# EAGLE design untitled (EAGLE 5.12)
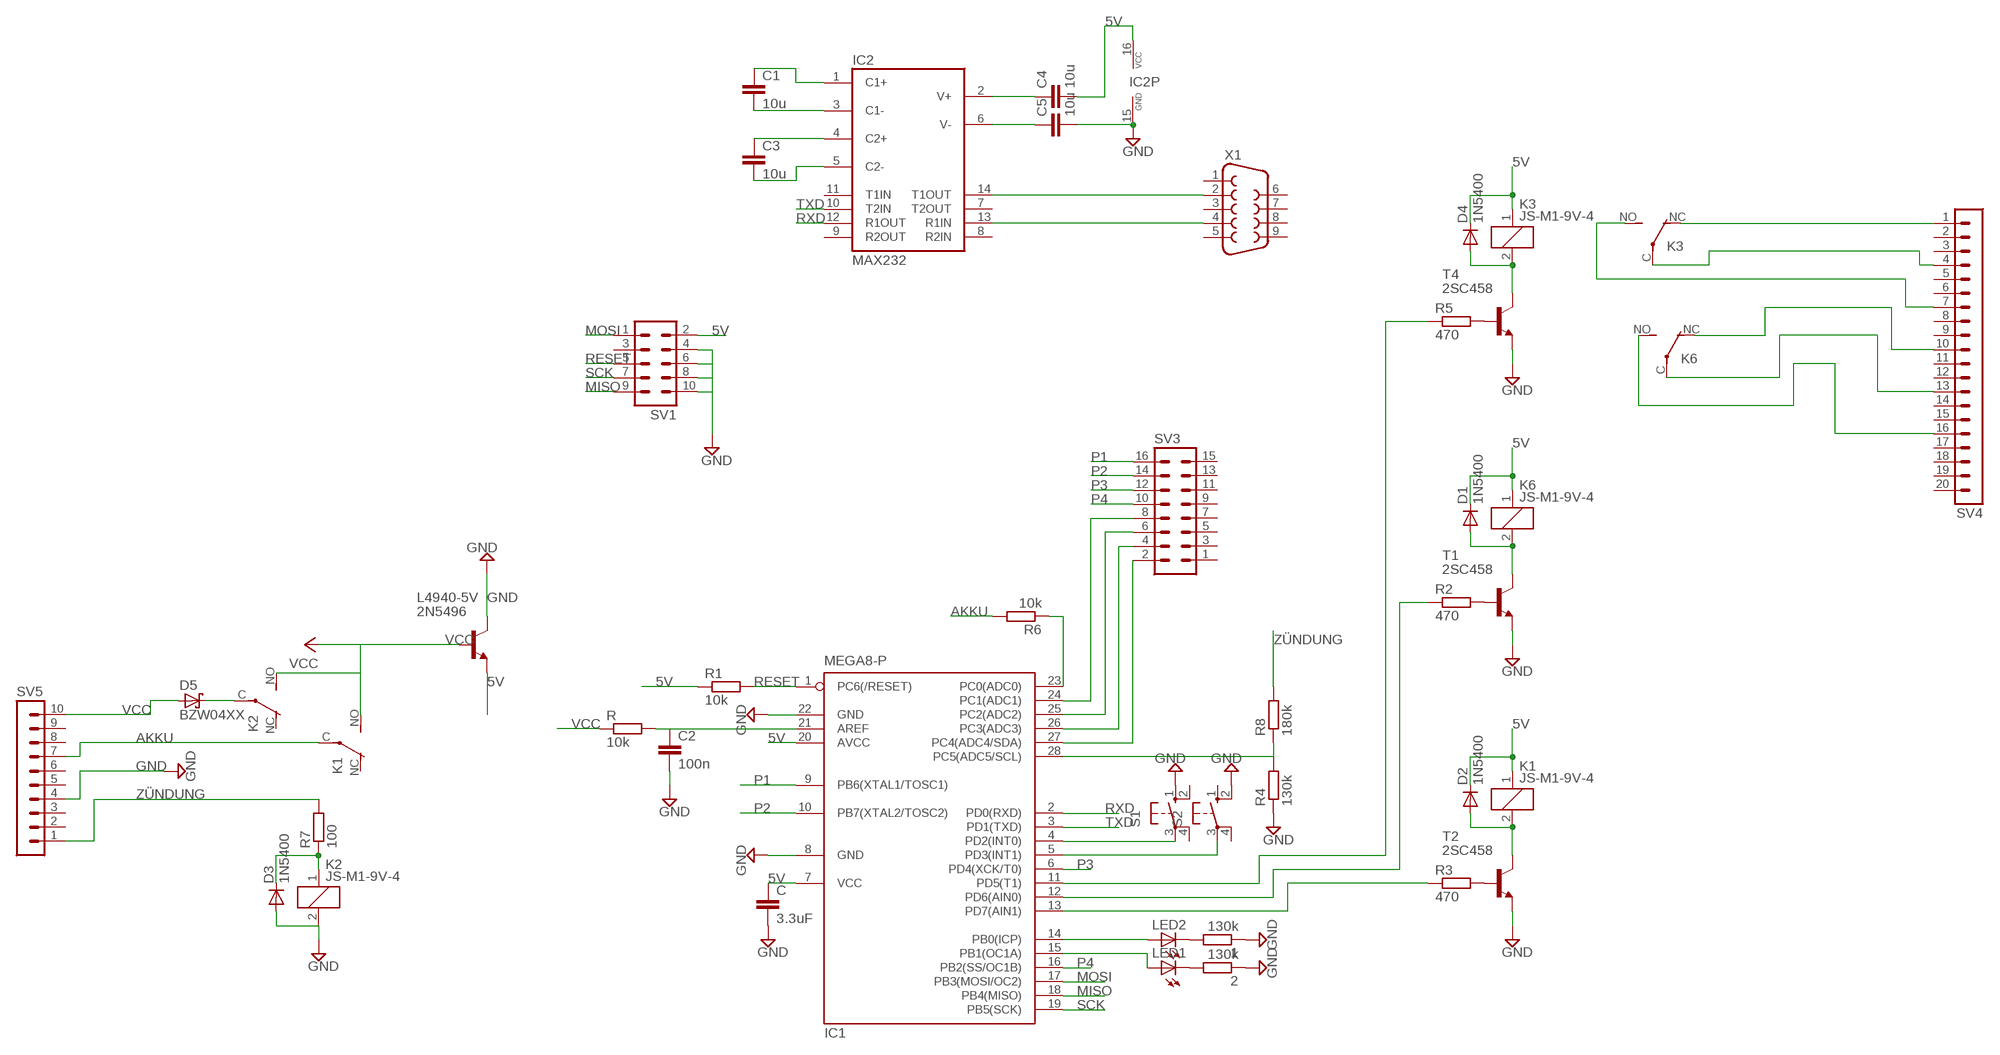
[diagram p0: schematic, sheet 1]

## Parts
1  130k  R-EU_0411/15  [0411/15]
2  130k  R-EU_0411/15  [0411/15]
C  3.3uF  C10/6  [C10B6]
C1  10u  C10/6  [C10B6]
C2  100n  C10/6  [C10B6]
C3  10u  C10/6  [C10B6]
C4  10u  C10/6  [C10B6]
C5  10u  C10/6  [C10B6]
D1  1N5400  [DO201-15]
D2  1N5400  [DO201-15]
D3  1N5400  [DO201-15]
D4  1N5400  [DO201-15]
D5  BZW04XX  [F126Z12]
IC1  MEGA8-P  [DIL28-3]
IC2  MAX232  [DIL16]
K1  JS-M1-9V-4  [JS-M]
K2  JS-M1-9V-4  [JS-M]
K3  JS-M1-9V-4  [JS-M]
K6  JS-M1-9V-4  [JS-M]
L4940-5V  2N5496  [TO220]
LED1  LED5MM  [LED5MM]
LED2  LED5MM  [LED5MM]
R  10k  R-EU_0411/15  [0411/15]
R1  10k  R-EU_0411/15  [0411/15]
R2  470  R-EU_0411/15  [0411/15]
R3  470  R-EU_0411/15  [0411/15]
R4  130k  R-EU_0411/15  [0411/15]
R5  470  R-EU_0411/15  [0411/15]
R6  10k  R-EU_0411/15  [0411/15]
R7  100  R-EU_0411/15  [0411/15]
R8  180k  R-EU_0411/15  [0411/15]
S1  10-XX  [B3F-10XX]
S2  10-XX  [B3F-10XX]
SV1  MA05-2  [MA05-2]
SV3  MA08-2  [MA08-2]
SV4  MA20-1  [MA20-1]
SV5  MA10-1  [MA10-1]
T1  2SC458  [TO92-ECB]
T2  2SC458  [TO92-ECB]
T4  2SC458  [TO92-ECB]
X1  F09HP  [F09HP]

## Nets
5V: C4.2 C.1 D1.C D2.C D4.C IC1.7(VCC) IC1.20(AVCC) IC2.16(VCC) K1.1 K3.1 K6.1 L4940-5V.3(E) R1.1 SV1.2
AKKU: K1.C(2:P) R6.2 SV5.7
GND: 1.1 2.1 C2.2 C5.2 C.2 D3.A IC1.8(GND) IC1.22(GND) IC2.15(GND) K2.2 L4940-5V.2(C) R4.1 S1.1(S) S2.2(S1) SV1.4 SV1.6 SV1.8 SV1.10 SV5.4 T1.E T2.E T4.E
MISO: IC1.18(PB4(MISO)) SV1.9
MOSI: IC1.17(PB3(MOSI/OC2)) SV1.1
N$1: D5.C K2.C(2:P)
N$2: R2.2 T1.B
N$3: K6.NC(2:O) SV4.10
N$4: K6.C(2:P) SV4.13
N$5: K6.NO(2:S) SV4.16
N$6: C2.1 IC1.21(AREF) R.2
N$7: D5.A SV5.10
N$8: D1.A K6.2 T1.C
N$9: IC1.28(PC5(ADC5/SCL)) R4.2 R8.1
N$10: D2.A K1.2 T2.C
N$11: R3.2 T2.B
N$12: C1.2 IC2.3(C1-)
N$13: C1.1 IC2.1(C1+)
N$14: C3.1 IC2.4(C2+)
N$15: C3.2 IC2.5(C2-)
N$16: C4.1 IC2.2(V+)
N$17: K3.C(2:P) SV4.4
N$18: K3.NO(2:S) SV4.7
N$19: K3.NC(2:O) SV4.1
N$20: D4.A K3.2 T4.C
N$21: R5.2 T4.B
N$22: IC1.13(PD7(AIN1)) R3.1
N$23: IC1.12(PD6(AIN0)) R2.1
N$24: IC1.23(PC0(ADC0)) R6.1
N$25: IC1.11(PD5(T1)) R5.1
N$26: C5.1 IC2.6(V-)
N$27: IC2.14(T1OUT) X1.2
N$28: IC2.13(R1IN) X1.4
N$29: IC1.27(PC4(ADC4/SDA)) SV3.2
N$30: IC1.26(PC3(ADC3)) SV3.4
N$31: IC1.25(PC2(ADC2)) SV3.6
N$32: IC1.24(PC1(ADC1)) SV3.8
N$33: IC1.4(PD2(INT0)) S1.3(P)
N$34: IC1.5(PD3(INT1)) S2.3(P)
N$35: 2.2 LED1.K(C)
N$36: IC1.15(PB1(OC1A)) LED1.A
N$37: 1.2 LED2.K(C)
N$38: IC1.14(PB0(ICP)) LED2.A
N$39: D3.C K2.1 R7.1
P1: IC1.9(PB6(XTAL1/TOSC1)) SV3.16
P2: IC1.10(PB7(XTAL2/TOSC2)) SV3.14
P3: IC1.6(PD4(XCK/T0)) SV3.12
P4: IC1.16(PB2(SS/OC1B)) SV3.10
RESET: IC1.1(PC6(/RESET)) R1.2 SV1.5
RXD: IC1.2(PD0(RXD)) IC2.12(R1OUT)
SCK: IC1.19(PB5(SCK)) SV1.7
TXD: IC1.3(PD1(TXD)) IC2.10(T2IN)
VCC: K1.NO(2:S) K2.NO(2:S) L4940-5V.1(B) R.1
ZÜNDUNG: R7.2 R8.2 SV5.1
Unconnected: IC2.7(T2OUT) IC2.8(R2IN) IC2.9(R2OUT) IC2.11(T1IN) K1.NC(2:O) K2.NC(2:O) S1.2(S1) S1.4(P1) S2.1(S) S2.4(P1) SV1.3 SV3.1 SV3.3 SV3.5 SV3.7 SV3.9 SV3.11 SV3.13 SV3.15 SV4.2 SV4.3 SV4.5 SV4.6 SV4.8 SV4.9 SV4.11 SV4.12 SV4.14 SV4.15 SV4.17 SV4.18 SV4.19 SV4.20 SV5.2 SV5.3 SV5.5 SV5.6 SV5.8 SV5.9 X1.1 X1.3 X1.5 X1.6 X1.7 X1.8 X1.9

## Library data of the parts
1 2 R R1-R8 = rcl:R-EU_: RESISTOR, European symbol
C C1-C5 = capacitor-wima:C: CAPACITOR naming: grid - package width
D1-D4 = diode:1N5400: DIODE standard rectifier, 3 A, 50 V (Motorola)
D5 = diode:BZW04XX: DIODE
IC1 = atmel:MEGA8-P: MICROCONTROLLER 8 Kbytes FLASH, 1 kbytes SRAM, 512 bytes EEPROM, USART, 4-channel 10 bit ADC, 2-channel 8 bit ADC Pin compatible with Atmega48, ATMega88, ATMega168 Source: avr.lbr; OC_FARNELL: unknown; OC_NEWARK: unknown
IC2 = maxim:MAX232: RS232 TRANSEIVER; MF: MAXIM; MPN: MAX232ACPE+; OC_FARNELL: 9723773; OC_NEWARK: 68K4544
K1-K3 K6 = relay:JS-M1*: Automotive Ultra-Miniature Power Relay NAiS Source: http://www.mew-europe.com/.. en_ds_61211_0000.pdf; OC_FARNELL: unknown; OC_NEWARK: unknown
L4940-5V = transistor:2N5496: NPN TRANSISTOR
LED1 LED2 = led:LED: LED OSRAM: - CHIPLED LG R971, LG N971, LY N971, LG Q971, LY Q971, LO R971, LY R971 LH N974, LH R974 LS Q976, LO Q976, LY Q976 LO Q996 - Hyper CHIPLED LW Q18S LB Q993, LB Q99A, LB R99A - SideLED LS A670, LO A670, LY A670, LG A670, LP A670 LB A673, LV A673, LT A673, LW A673 LH A674 LY A675 LS A676, LA A676, LO A676, LY A676, LW A676 LS A679, LY A679, LG A679 - Hyper Micro SIDELED® LS Y876, LA Y876, LO Y876, LY Y876 LT Y87S - SmartLED LW L88C, LW L88S LB L89C, LB L89S, LG L890 LS L89K, LO L89K, LY L89K LS L896, LA L896, LO L896, LY L896 - TOPLED LS T670, LO T670, LY T670, LG T670, LP T670 LSG T670, LSP T670, LSY T670, LOP T670, LYG T670 LG T671, LOG T671, LSG T671 LB T673, LV T673, LT T673, LW T673 LH T674 LS T676, LA T676, LO T676, LY T676, LB T676, LH T676, LSB T676, LW T676 LB T67C, LV T67C, LT T67C, LS T67K, LO T67K, LY T67K, LW E67C LS E67B, LA E67B, LO E67B, LY E67B, LB E67C, LV E67C, LT E67C LW T67C LS T679, LY T679, LG T679 LS T770, LO T770, LY T770, LG T770, LP T770 LB T773, LV T773, LT T773, LW T773 LH T774 LS E675, LA E675, LY E675, LS T675 LS T776, LA T776, LO T776, LY T776, LB T776 LHGB T686 LT T68C, LB T68C - Hyper Mini TOPLED® LB M676 - Mini TOPLED Santana® LG M470 LS M47K, LO M47K, LY M47K Source: http://www.osram.convergy.de LUXEON: - LUMILED® LXK2-PW12-R00, LXK2-PW12-S00, LXK2-PW14-U00, LXK2-PW14-V00 LXK2-PM12-R00, LXK2-PM12-S00, LXK2-PM14-U00 LXK2-PE12-Q00, LXK2-PE12-R00, LXK2-PE12-S00, LXK2-PE14-T00, LXK2-PE14-U00 LXK2-PB12-K00, LXK2-PB12-L00, LXK2-PB12-M00, LXK2-PB14-N00, LXK2-PB14-P00, LXK2-PB14-Q00 LXK2-PR12-L00, LXK2-PR12-M00, LXK2-PR14-Q00, LXK2-PR14-R00 LXK2-PD12-Q00, LXK2-PD12-R00, LXK2-PD12-S00 LXK2-PH12-R00, LXK2-PH12-S00 LXK2-PL12-P00, LXK2-PL12-Q00, LXK2-PL12-R00 Source: www.luxeon.com KINGBRIGHT: KA-3528ASYC Source: www.kingbright.com
S1 S2 = switch-omron:10-XX: OMRON SWITCH; MPN: B3F-1000; OC_FARNELL: 176432; OC_NEWARK: 36M3542
SV1 = con-lstb:MA05-2: PIN HEADER; OC_FARNELL: unknown; OC_NEWARK: unknown
SV3 = con-lstb:MA08-2: PIN HEADER; OC_FARNELL: unknown; OC_NEWARK: unknown
SV4 = con-lstb:MA20-1: PIN HEADER; OC_FARNELL: unknown; OC_NEWARK: unknown
SV5 = con-lstb:MA10-1: PIN HEADER; OC_FARNELL: unknown; OC_NEWARK: unknown
T1 T2 T4 = transistor:2SC458: NPN Silicon Epitaxial Planar Transistor Source: SEMTECH ELECTRONICS LTD. ... 2SC458 1.pdf
X1 = con-subd:F09: SUB-D; OC_FARNELL: unknown; OC_NEWARK: unknown

## Board
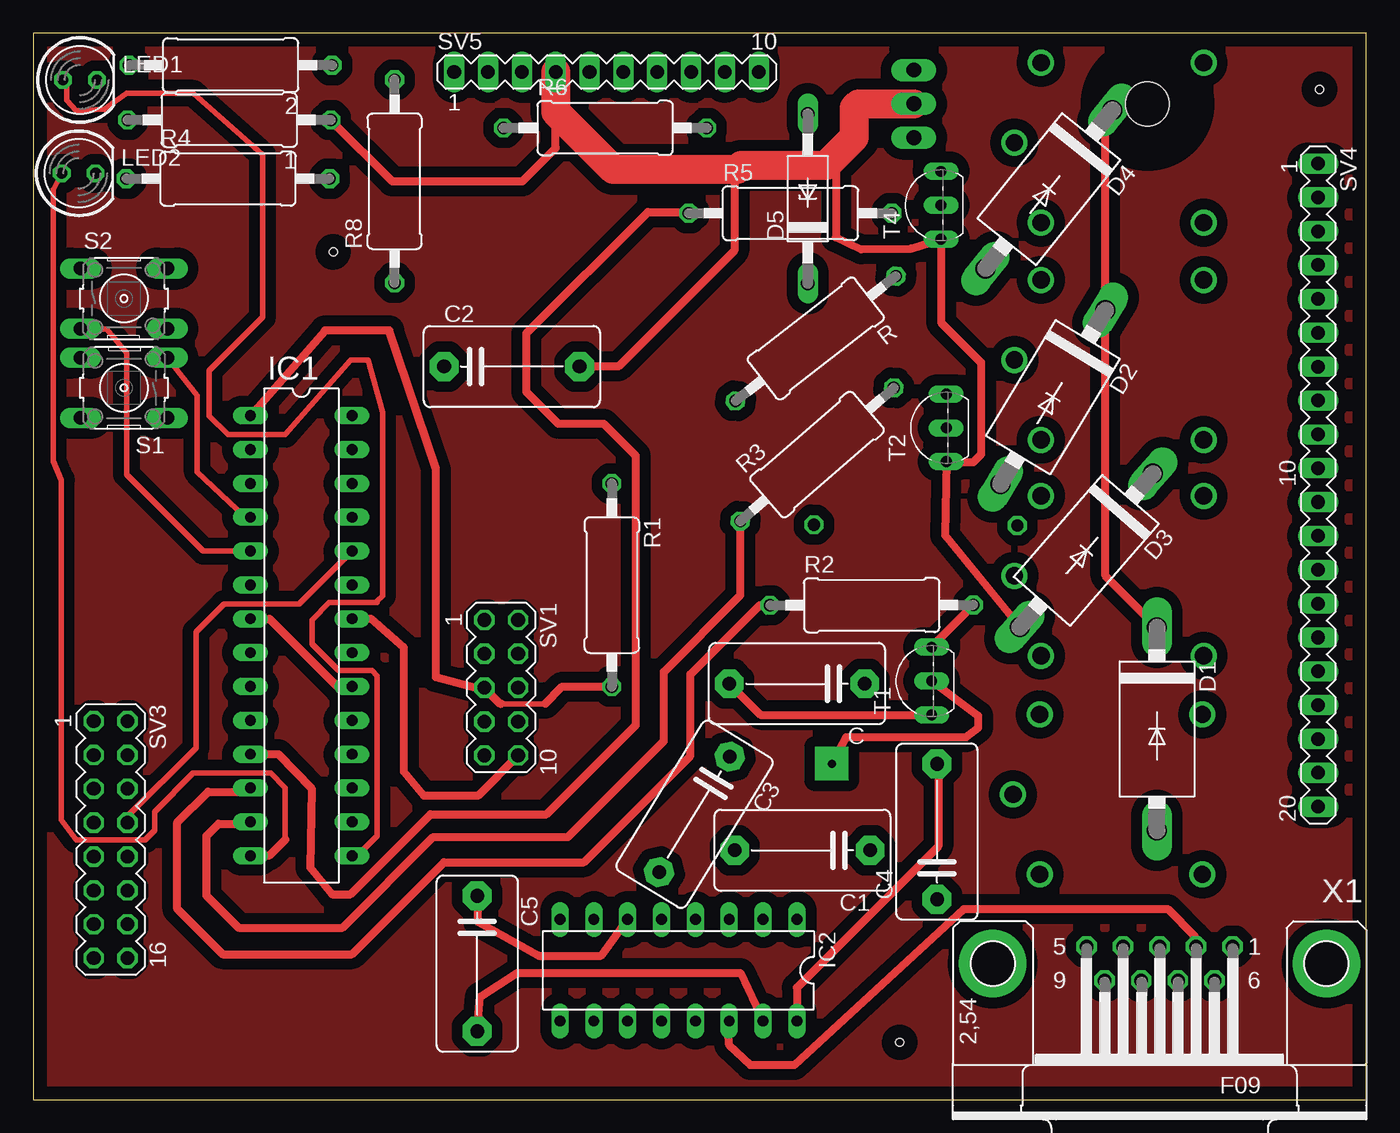
[diagram p1: board, top side]
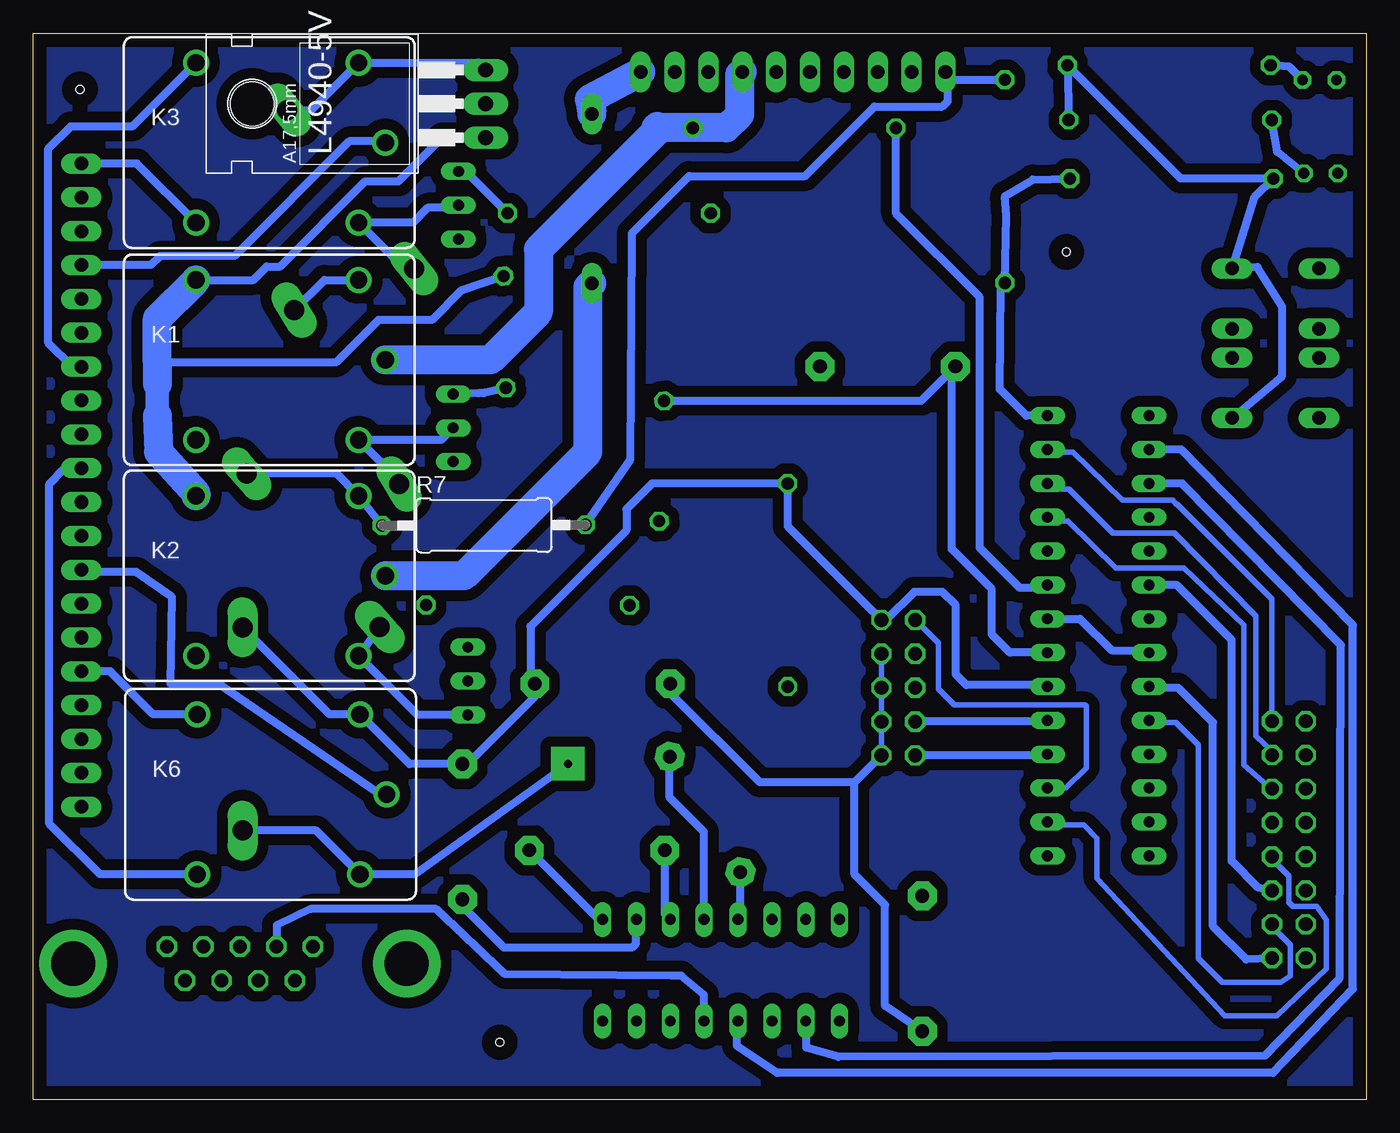
[diagram p2: board, bottom side, seen from below]

Size 100 x 80 mm. Coordinates in mm from the lower left corner, seen from the top.
Outline: 0,0 100,0 100,80 0,80 0,0
Copper layers (1*16): Top 0.035mm / dielectric 1.5mm / Bottom 0.035mm
Design rules "default": minimum track width 10mil, minimum drill 24mil, track to track 8mil, track to pad 8mil, pad to pad 8mil, via to via 8mil, smd to smd 8mil, copper to edge 40mil, drill to drill 8mil, minimum pad ring 10mil, minimum via ring 8mil, stop-mask expansion 4mil, vias tented up to drill 0mil, thermal gap 10mil
Holes 0.6 mm at 65,4.3 22.5,63.6 96.5,75.8

### Footprints (pad centres in the part's own frame; a part is rotated, then mirrored left to right if it is on the bottom)
0411/15 = drill 0.914 octagon: 1 -7.62,0; 2 7.62,0
C10B6 = drill 1.016 pad 2.159 octagon: 1 -5.08,0; 2 5.08,0
DO201-15 = drill 1.499 long: A 7.62,0; C -7.62,0
F126Z12 = drill 1.016 long: A 6.35,0; C -6.35,0
DIL28-3 = drill 0.813 long: 1 -16.51,-3.81; 2 -13.97,-3.81; 3 -11.43,-3.81; 4 -8.89,-3.81; 5 -6.35,-3.81; 6 -3.81,-3.81; 7 -1.27,-3.81; 8 1.27,-3.81; 9 3.81,-3.81; 10 6.35,-3.81; 11 8.89,-3.81; 12 11.43,-3.81; 13 13.97,-3.81; 14 16.51,-3.81; 15 16.51,3.81; 16 13.97,3.81; 17 11.43,3.81; 18 8.89,3.81; 19 6.35,3.81; 20 3.81,3.81; 21 1.27,3.81; 22 -1.27,3.81; 23 -3.81,3.81; 24 -6.35,3.81; 25 -8.89,3.81; 26 -11.43,3.81; 27 -13.97,3.81; 28 -16.51,3.81
DIL16 = drill 0.813 long: 1 -8.89,-3.81; 2 -6.35,-3.81; 3 -3.81,-3.81; 4 -1.27,-3.81; 5 1.27,-3.81; 6 3.81,-3.81; 7 6.35,-3.81; 8 8.89,-3.81; 9 8.89,3.81; 10 6.35,3.81; 11 3.81,3.81; 12 1.27,3.81; 13 -1.27,3.81; 14 -3.81,3.81; 15 -6.35,3.81; 16 -8.89,3.81
JS-M = drill 1.3 round: 1 6.7,6; 2 6.7,-6; C 8.7,0; NC -5.5,-6; NO -5.5,6
TO220 = drill 1.118 long: 1 -2.54,-6.35; 2 0,-6.35; 3 2.54,-6.35 | hole 3.302: 0,11.176
LED5MM = drill 0.813 octagon: A -1.27,0; K 1.27,0
B3F-10XX = drill 1.016 long: 1 -3.251,2.261; 2 3.251,2.261; 3 -3.251,-2.261; 4 3.251,-2.261
MA05-2 = drill 1.016 octagon: 1 -5.08,-1.27; 2 -5.08,1.27; 3 -2.54,-1.27; 4 -2.54,1.27; 5 0,-1.27; 6 0,1.27; 7 2.54,-1.27; 8 2.54,1.27; 9 5.08,-1.27; 10 5.08,1.27
MA08-2 = drill 1.016 octagon: 1 -8.89,-1.27; 2 -8.89,1.27; 3 -6.35,-1.27; 4 -6.35,1.27; 5 -3.81,-1.27; 6 -3.81,1.27; 7 -1.27,-1.27; 8 -1.27,1.27; 9 1.27,-1.27; 10 1.27,1.27; 11 3.81,-1.27; 12 3.81,1.27; 13 6.35,-1.27; 14 6.35,1.27; 15 8.89,-1.27; 16 8.89,1.27
MA20-1 = drill 1.016 long: 1 -24.13,0; 2 -21.59,0; 3 -19.05,0; 4 -16.51,0; 5 -13.97,0; 6 -11.43,0; 7 -8.89,0; 8 -6.35,0; 9 -3.81,0; 10 -1.27,0; 11 1.27,0; 12 3.81,0; 13 6.35,0; 14 8.89,0; 15 11.43,0; 16 13.97,0; 17 16.51,0; 18 19.05,0; 19 21.59,0; 20 24.13,0
MA10-1 = drill 1.016 long: 1 -11.43,0; 2 -8.89,0; 3 -6.35,0; 4 -3.81,0; 5 -1.27,0; 6 1.27,0; 7 3.81,0; 8 6.35,0; 9 8.89,0; 10 11.43,0
TO92-ECB = drill 0.813 long: B 2.54,0; C 0,0; E -2.54,0
F09HP = drill 1.016 octagon: 1 -5.486,-1.27; 2 -2.743,-1.27; 3 0,-1.27; 4 2.743,-1.27; 5 5.486,-1.27; 6 -4.115,1.27; 7 -1.372,1.27; 8 1.372,1.27; 9 4.115,1.27 | drill 3.302 pad 5.08 round: G1 -12.522,0; G2 12.522,0

### Placement (x,y rotation side)
1  14.7,73.5 180 top
2  14.8,77.6 180 top
C  57.3,31.2 180 top
C1  57.7,18.7 180 top
C2  35.9,55 0 top
C3  49.6,21.4 238.5 top
C4  67.8,20.1 90 top
C5  33.3,10.2 270 top
D1  84.3,27.8 270 top
D2  76.5,52.7 238.9 top
D3  79,41.2 229 top
D4  76.2,68.3 231.3 top
D5  58.1,67.6 90 top
IC1  20.1,34.8 270 top
IC2  48.4,9.7 180 top
K1  82.3,55.5 0 bottom
K2  82.3,39.3 0 bottom
K3  82.3,71.8 0 bottom
K6  82.2,22.9 0 bottom
L4940-5V  72.41,74.71 90 bottom
LED1  3.5,76.5 0 top
LED2  3.4,69.5 0 top
R  58.7,57.1 217.9 top
R1  43.4,38.6 270 top
R2  62.9,37.1 0.1 top
R3  58.8,48.4 41 top
R4  14.6,69.1 0 top
R5  56.8,66.5 0 top
R6  42.9,72.9 0 top
R7  66.2,43.1 0.2 bottom
R8  27.1,68.9 90 top
S1  6.8,53.4 180 top
S2  6.8,60.1 0 top
SV1  35.1,30.9 270 top
SV3  5.8,19.5 270 top
SV4  96.4,46.1 270 top
SV5  43,77.1 0 top
T1  67.4,31.4 90 top
T2  68.5,50.4 90 top
T4  68.1,67.1 90 top
X1  84.5,10.2 180 top

### Tracks (layer width: path | path; a pad name or v marks a point on that pad's centre or on a via)
5V
  Top 0.61: IC2.16 57.29,8.39 67.9,19 67.9,25.08 C4.2 | IC1.7 17.73,36.07 22.8,31 IC1.20 | D1.C 80.44,39.28 D2.C 80.44,73.72 D4.C
  Bottom 0.61: IC1.20 24.02,31.1 30,31.1 30.8,31.9 30.8,37.1 31.8,38.1 33.9,38.1 36.02,35.98 SV1.2 43.4,43.01 R1.1 53.58,46.22 55.5,44.3 55.5,42.7 62.7,35.5 62.7,31.52 C.1 62.38,30.22 67.9,24.7 67.9,25.08 C4.2 71.78,25.18 K6.1 77.78,28.9 D1.C | D2.C 78.16,61.5 K1.1 | L4940-5V.3 66.61,77.8 K3.1 79.15,74.25 D4.C
AKKU
  Bottom 0.61: R6.2 53.1,72.9 53.2,73
  Bottom 2.184: K1.C 65.7,55.5 62.1,59.1 62.1,63.8 53.2,72.7 53.2,73 53.3,72.9 48,72.9 47,73.9 47,76.91 SV5.7
GND
  Top 0.61: 62.1,74.2 61.01,71.61 60.2,69.7 60.2,64.7 62.1,63.8 65.86,63.86 T4.E 68.1,58.3 71.1,55.3 71.1,48.4 70.5,47.8 68.56,47.8 T2.E 68.4,42.35 D3.A | L4940-5V.2 | C5.2 33.5,7.7 36.3,9.5 53.04,9.5 IC2.15 54.75,5.85 54.7,5.8 | C2.2 43.9,55 52.6,63.7 52.6,69.6 53.1,70.1 | T1.E 54.56,28.86 C.2 | IC1.22 25.33,36.07 27.8,33.9 27.8,24.6 29.3,22.8 33.35,22.8 SV1.10 | SV5.4 39.19,71.39 36.7,68.9 26.92,68.9 1.1
  Top 2.184: SV5.4 39.19,74.11 43.5,69.8 52.8,69.8 53.1,70.1 59.5,70.1 61.01,71.61 61.6,72.2 61.6,74.4 61.91,74.71 L4940-5V.2
  Bottom 0.406: SV1.10 SV1.8 SV1.6 SV1.4
  Bottom 0.61: T1.E 71.16,28.86 K2.2 D3.A | 1.1 2.1 13.92,69.1 R4.1 8.35,67.73 S2.2 8.16,62.46 6.3,59.5 6.3,54.29 S1.1 | IC1.22 21.47,36.07 19.1,33.7 16.46,33.7 IC1.8 | C.2 52.22,30.52 45.5,23.8 38.39,23.8 | 38.39,23.8 SV1.10 | 38.39,23.8 38.39,16.89 36.1,14.6 36.1,7.02 C5.2
MISO
  Bottom 0.61: SV1.9 24,25.82 IC1.18
MOSI
  Bottom 0.406: IC1.17 22.53,23.37 21,24.9 21,29.5 21.1,29.6 30.9,29.6 32.1,30.8 32.1,34.25 SV1.1
N$1
  Bottom 2.184: K2.C 67.7,39.3 58.4,48.6 58.4,60.95 D5.C
N$2
  Top 0.61: T1.B 67.4,33.99 R2.2
N$3
  Bottom 0.61: K6.NC 95,16.9 98.8,20.7 98.8,46.2 97.7,47.3 96.47,47.3 SV4.10
N$4
  Bottom 0.61: K6.C 74,22.9 86.1,31.2 89.7,31.2 89.6,37.7 92.3,39.6 96.25,39.6 SV4.13
N$5
  Bottom 0.61: SV4.16 94.23,32.13 91,28.9 K6.NO
N$6
  Bottom 0.61: IC1.21 26.73,33.53 28.1,34.9 28.1,38.3 31.1,41.3 31.1,54.72 C2.1 33.4,52.42 R.2
N$7
  Bottom 2.184: D5.A 58.28,75.05 SV5.10
N$8  (via drill 0.6 pad 2.54)
  Top 0.61: T1.C 70.9,28.8 70.9,27.9 70,27.2 61,27.2 v59.9,25.2
  Bottom 0.61: D1.A 78.78,20.18 K6.2 71.4,16.9 v59.9,25.2
N$9
  Bottom 0.61: R4.2 25.02,69.02 27.1,67.8 27,66.32 R8.1 27.4,60.98 27.5,53.3 25.51,51.31 IC1.28
N$10
  Bottom 0.61: T2.C 69.4,49.5 K1.2 72.56,46.46 D2.A
N$11
  Bottom 0.61: R3.2 66.2,53 66.6,53 68.46,52.9 T2.B
N$12
  Bottom 0.61: C1.2 52.62,13.92 IC2.3
N$13
  Bottom 0.61: IC2.1 57.59,13.51 C1.1
N$14
  Bottom 0.61: C3.1 52.25,22.65 49.7,20.1 49.7,13.54 IC2.4
N$15
  Bottom 0.61: C3.2 46.95,13.69 IC2.5
N$16
  Bottom 0.61: C4.1 67.8,14.5 64.7,11.4 55.1,11.4 54.8,11.7 54.8,13.46 IC2.2
N$17
  Bottom 0.61: SV4.4 91.19,62.61 90.5,63.3 84.9,63.3 76.3,71.9 73.7,71.9 K3.C
N$18
  Bottom 0.61: K3.NO 92.6,73 97.2,73 98.9,71.3 98.9,56.8 97.09,54.99 SV4.7
N$19
  Bottom 0.61: SV4.1 92.23,70.23 K3.NC
N$20
  Bottom 0.61: T4.C 68.3,66.9 70.4,66.9 71.5,65.8 K3.2 72.15,62.35 D4.A
N$21
  Bottom 0.61: T4.B 68.24,69.64 68.4,69.8 67.72,69.8 R5.2
N$22
  Top 0.61: R3.1 53.05,37.85 47.3,32.1 47.3,26.9 40.1,19.7 30,19.7 23.2,12.9 15.4,12.9 13,15.3 13,19.8 13.9,20.7 16.16,20.7 IC1.13
N$23
  Top 0.61: R2.1 54.49,37.09 49.3,31.9 49.3,25.8 41.3,17.8 30.8,17.8 23.9,10.9 14.2,10.9 10.8,14.3 10.8,20.8 13.1,23.1 16.02,23.1 IC1.12
N$24
  Bottom 0.61: R6.1 35.28,66.48 29,60.2 29,41.4 26,38.4 24.12,38.4 IC1.23
N$25
  Top 0.61: IC1.11 18.39,25.91 20.9,23.3 20.8,17.4 22.4,15.4 23.8,15.4 29.8,21.4 38.5,21.4 45.2,28.1 45.2,48.3 42.8,50.7 39.4,50.7 37,53.1 37,57.5 46.1,66.6 49.08,66.6 R5.1
N$26
  Top 0.61: C5.1 33.4,13.3 37.9,10.8 42.58,10.8 IC2.6
N$27
  Top 0.61: X1.2 87.14,12.26 85.1,14.3 69.8,14.3 57.1,2.6 53.8,2.6 52.2,4.1 52.1,5.78 IC2.14
N$28
  Bottom 0.61: X1.4 81.73,13.07 79.2,14.3 69.8,14.3 64.6,9.4 52.1,9.3 51.4,9.3 49.7,7.86 IC2.13
N$29
  Bottom 0.406: SV3.2 7.07,37.57 14.2,44.7 14.3,44.7 14.5,45 18.3,45 22,48.6 23.74,48.6 IC1.27
N$30
  Bottom 0.406: SV3.4 7.07,26.17 8.3,27.3 8.3,36.3 14.4,42.5 19,42.5 22.3,45.8 23.48,45.8 IC1.26
N$31
  Bottom 0.406: SV3.6 7.11,23.31 9.2,25.1 9.2,35.6 13.7,39.9 18.8,39.9 22.4,43.4 23.62,43.4 IC1.25
N$32
  Top 0.406: SV3.8 7.07,21.27 12.2,26.4 12.2,35.1 14.3,37.2 19.96,37.2 IC1.24
N$33
  Top 0.406: IC1.4 15.91,43.69 12.3,47.1 12.3,52.81 S1.3
N$34
  Top 0.406: IC1.5 12.75,41.15 7,46.9 7,56 5.5,57.8 5.21,57.8 S2.3
N$35
  Bottom 0.61: 2.2 5.77,77.5 LED1.K
N$36
  Top 0.406: IC1.15 24.29,18.29 25.8,19.8 25.8,31.8 25.4,32.2 22.9,32.2 20.9,34.2 20.9,36 22.2,37.3 25.8,37.3 25.8,37.4 26.2,37.8 26.2,51.6 25.1,55.5 23.8,55.5 18.9,49.9 14.6,49.9 13.2,51.3 13.2,54.7 17.2,58.7 17.2,70.9 12,75.5 7,75.5 5.3,74.3 3.2,74.2 2.5,75 2.5,76.23 LED1.A
N$37
  Bottom 0.61: 1.2 6.68,71.11 LED2.K
N$38
  Top 0.406: 18.9,19.5 18.9,23.4 17.8,24.5 12,24.5 9.1,21.6 9.1,20.2 8.4,19.5 3.2,19.5 2.1,21 2.1,46.5 1.5,47.9 1.5,68.27 LED2.A
  Top 0.61: IC1.14 17.69,18.29 18.9,19.5
N$39
  Bottom 0.61: D3.C 77.25,46.95 K2.1 R7.1
N$40
  pour Bottom (isolate 0.813): 0.6,79.5 100,79.8 100,0.4 -0.1,0.1 -0.1,79.4
N$41
  pour Top (isolate 0.813): 0.5,79.6 99.9,79.8 99.9,0.6 0,0 0,79.4
P1
  Bottom 0.61: SV3.16 9.01,10.51 11.5,13 11.5,28.3 14.1,30.9 16.2,30.9 IC1.9
P2
  Bottom 0.406: SV3.14 7.07,12.87 7,13.2 6.8,12.7 5.7,11.6 5.7,9.3 6.4,8.8 10.8,8.8 12.6,10.6 12.6,26.6 14.3,28.3 16.14,28.3 IC1.10
P3
  Bottom 0.61: SV3.12 8.09,15.89 10.1,17.9 10.1,34.5 14.2,38.6 IC1.6
P4
  Bottom 0.406: SV3.10 7.07,18.07 5.8,16.8 5.8,14.8 5.5,14.5 3.7,14.5 3,13.5 3,9.8 6.7,6.3 10.6,6.3 20.2,16.6 20.2,19.6 21.2,20.6 23.68,20.6 IC1.16
RESET
  Top 0.406: 35.1,29.7 38.4,29.7
  Top 0.61: R1.2 39.68,30.98 38.4,29.7 | 35.1,29.7 35.03,29.7 SV1.5 33.3,30.9 30.2,31.7 30.2,47.3 26.7,57.7 21.88,57.7 IC1.1
RXD
  Bottom 0.61: IC1.2 13.87,48.77 1,35.6 1,8.3 7,2 44.2,2 47.2,4 47.2,5.82 IC2.12
SCK
  Bottom 0.61: SV1.7 24,28.36 IC1.19
TXD
  Bottom 0.61: IC1.3 13.83,46.23 1.9,34.1 2,9.1 7.6,3.3 39.6,3.2 42,3.9 42,5.84 IC2.10
VCC
  Bottom 0.61: K1.NO 83.5,61.5 82.5,62.5 81.5,62.5 75.1,68.9 72.6,68.9 69.3,72.2 66.09,72.2 L4940-5V.1 | R.1 67.92,60.68 70.1,58.5 74.1,58.5 77.3,55.3 90.7,55.3 90.7,55.1
  Bottom 1.778: 90.7,53.7 90.7,51.3
  Bottom 2.184: K2.NO 87.8,45.5 90.6,48.6 90.7,51.3 | 90.7,55.1 90.7,53.7 | 90.7,55.3 90.7,58.6 K1.NO
ZÜNDUNG
  Bottom 0.61: R7.2 55.2,48.03 55.1,64.5 55.1,65 50.8,69.3 42.1,69.3 36.9,74.5 31.8,74.5 31.4,74.9 31.4,76.93 SV5.1 30.99,76.52 R8.2